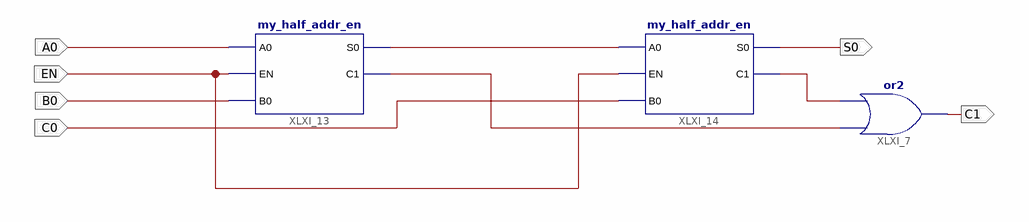
[diagram p0: schematic sheet 1]
// Xilinx ISE schematic my_full_addr.sch (virtex6) as structural Verilog: 3 symbols, 6 ports
module my_full_addr (
  input  A0,
  input  EN,
  input  C0,
  input  B0,
  output S0,
  output C1
);

  wire XLXN_3, XLXN_12, XLXN_13;

  or XLXI_7 (C1, XLXN_12, XLXN_13);
  my_half_addr_en XLXI_13 (.A0(A0), .B0(B0), .C1(XLXN_12), .EN(EN), .S0(XLXN_3));
  my_half_addr_en XLXI_14 (.A0(XLXN_3), .B0(C0), .C1(XLXN_13), .EN(EN), .S0(S0));
endmodule
